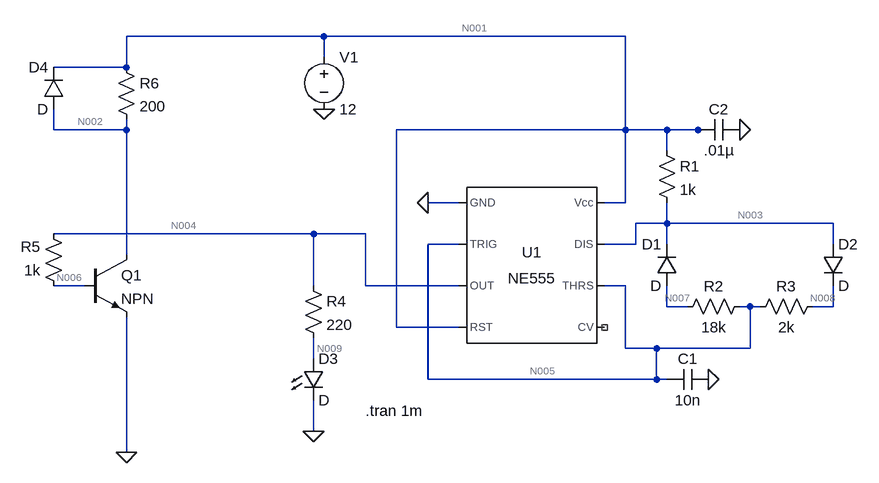
[diagram p0: schematic test-1.asc]
test-1.asc, the LTspice schematic file:
Version 4
SHEET 1 880 680
WIRE -128 -160 -432 -160
WIRE 336 -160 -128 -160
WIRE -128 -128 -128 -160
WIRE -432 -112 -432 -160
WIRE -432 -112 -544 -112
WIRE -544 -16 -544 -48
WIRE -432 -16 -432 -32
WIRE -432 -16 -544 -16
WIRE 336 -16 336 -160
WIRE 336 -16 -16 -16
WIRE 400 -16 336 -16
WIRE 448 -16 400 -16
WIRE 464 -16 448 -16
WIRE 400 16 400 -16
WIRE 80 96 32 96
WIRE 336 96 336 -16
WIRE 336 96 304 96
WIRE 400 128 400 96
WIRE 400 128 352 128
WIRE 656 128 400 128
WIRE -144 144 -544 144
WIRE -64 144 -144 144
WIRE 80 160 32 160
WIRE 352 160 352 128
WIRE 352 160 304 160
WIRE 400 160 400 128
WIRE 656 160 656 128
WIRE -432 176 -432 -16
WIRE -496 224 -544 224
WIRE -144 224 -144 144
WIRE -64 224 -64 144
WIRE 80 224 -64 224
WIRE 336 224 304 224
WIRE 400 256 400 224
WIRE 432 256 400 256
WIRE 528 256 512 256
WIRE 544 256 528 256
WIRE 656 256 656 224
WIRE 656 256 624 256
WIRE -16 288 -16 -16
WIRE 80 288 -16 288
WIRE 336 320 336 224
WIRE 384 320 336 320
WIRE 528 320 528 256
WIRE 528 320 384 320
WIRE -144 336 -144 304
WIRE 32 368 32 160
WIRE 384 368 384 320
WIRE 384 368 32 368
WIRE 400 368 384 368
WIRE -144 448 -144 400
WIRE -432 480 -432 272
FLAG 32 96 0
FLAG 464 368 0
FLAG 512 -16 0
FLAG -128 -48 0
FLAG -144 448 0
FLAG -432 480 0
SYMBOL Misc\\NE555 192 192 R0
SYMATTR InstName U1
SYMBOL cap 464 352 R90
WINDOW 0 0 32 VBottom 2
WINDOW 3 32 32 VTop 2
SYMATTR InstName C1
SYMATTR Value 10n
SYMBOL cap 512 -32 R90
WINDOW 0 0 32 VBottom 2
WINDOW 3 32 32 VTop 2
SYMATTR InstName C2
SYMATTR Value .01µ
SYMBOL voltage -128 -144 R0
SYMATTR InstName V1
SYMATTR Value 12
SYMBOL res 384 0 R0
SYMATTR InstName R1
SYMATTR Value 1k
SYMBOL diode 416 224 R180
WINDOW 0 24 64 Left 2
WINDOW 3 24 0 Left 2
SYMATTR InstName D1
SYMBOL diode 640 160 R0
SYMATTR InstName D2
SYMBOL res 528 240 R90
WINDOW 0 0 56 VBottom 2
WINDOW 3 32 56 VTop 2
SYMATTR InstName R2
SYMATTR Value 18k
SYMBOL res 640 240 R90
WINDOW 0 0 56 VBottom 2
WINDOW 3 32 56 VTop 2
SYMATTR InstName R3
SYMATTR Value 2k
SYMBOL res -160 208 R0
SYMATTR InstName R4
SYMATTR Value 220
SYMBOL LED -160 336 R0
SYMATTR InstName D3
SYMBOL npn -496 176 R0
SYMATTR InstName Q1
SYMBOL res -528 240 R180
WINDOW 0 36 76 Left 2
WINDOW 3 36 40 Left 2
SYMATTR InstName R5
SYMATTR Value 1k
SYMBOL res -448 -128 R0
SYMATTR InstName R6
SYMATTR Value 200
SYMBOL diode -528 -48 R180
WINDOW 0 24 64 Left 2
WINDOW 3 24 0 Left 2
SYMATTR InstName D4
TEXT -64 416 Left 2 !.tran 1m

The netlist it stands for:
* test-1.asc
XU1 0 N005 N004 N001 NC_01 N005 N003 N001 NE555  ; pins GND TRIG OUT RST CV THRS DIS Vcc
C1 0 N005 10n
C2 0 N001 .01µ
V1 N001 0 12
R1 N001 N003 1k
D1 N007 N003 D
D2 N003 N008 D
R2 N005 N007 18k
R3 N008 N005 2k
R4 N004 N009 220
D3 N009 0 D
Q1 N002 N006 0 0 NPN
R5 N006 N004 1k
R6 N001 N002 200
D4 N002 N001 D
.model D D
.lib standard.dio
.model NPN NPN
.model PNP PNP
.lib standard.bjt
.tran 1m
.lib NE555.sub
.backanno
.end

* Results of the author's LTspice run, read from the files saved beside the schematic
* Operating Point, zero values left out:
*   V(n005) = 11.62 V
*   V(n001) = 12 V
*   V(n003) = 12 V
*   V(n004) = 11.64 V
*   V(n007) = 11.62 V
*   V(n008) = 11.62 V
*   V(n009) = 756 mV
*   V(n002) = 53.79 mV
*   V(n006) = 887.5 mV
*   Ic(Q1) = 59.73 mA
*   Ib(Q1) = 10.75 mA
*   Ie(Q1) = -70.48 mA
*   I(D4) = -11.96 pA
*   I(D3) = 49.47 mA
*   I(D2) = 23.25 nA
*   I(R6) = 59.73 mA
*   I(R5) = -10.75 mA
*   I(R4) = 49.47 mA
*   I(R3) = 23.24 nA
*   I(R1) = 39.25 nA
*   I(V1) = -123.8 mA
*   Ix(u1:1) = -3.881 mA
*   Ix(u1:2) = 11.62 nA
*   Ix(u1:3) = -60.22 mA
*   Ix(u1:4) = 69.33 µA
*   Ix(u1:6) = 11.62 nA
*   Ix(u1:7) = 16.01 nA
*   Ix(u1:8) = 64.03 mA
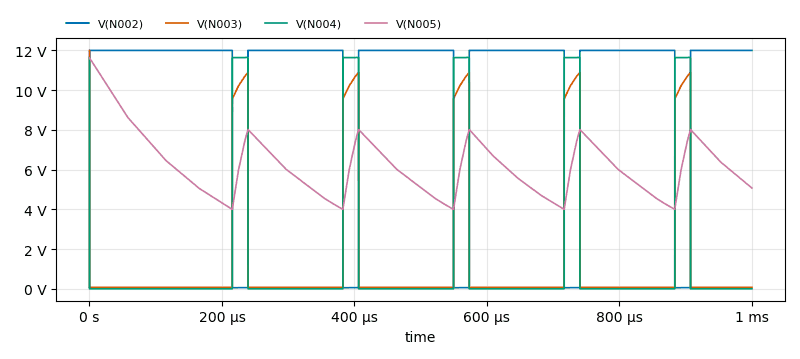
[diagram p1: Transient Analysis of test-1.asc, plotted from the saved traces]
* Transient Analysis, 1 run:
*   V(N002): min 53.76 mV, max 12 V, average 10.58 V, rms 11.26 V, last 12 V
*   V(N003): min 72.67 mV, max 12 V, average 1.292 V, rms 3.56 V, last 73.02 mV
*   V(N004): min 72 µV, max 11.65 V, average 1.381 V, rms 4.008 V, last 72 µV
*   V(N005): min 3.998 V, max 11.62 V, average 6.183 V, rms 6.404 V, last 5.073 V